# Altium schematic sheet M-LVDS PHY.SchDoc: Mordovia_MCH_CLK
size 420 x 297 mm; Date: 2021; DrawnBy: Filip Świtakowski; DocumentNumber: 3; Revision: 1.0; SheetNumber: 3; SheetTotal: 4; ModifiedBy: -; CheckedDate: -; Title2: M-LVDS PHY; DivGrp: WUT ISE; Designer: Filip Świtakowski
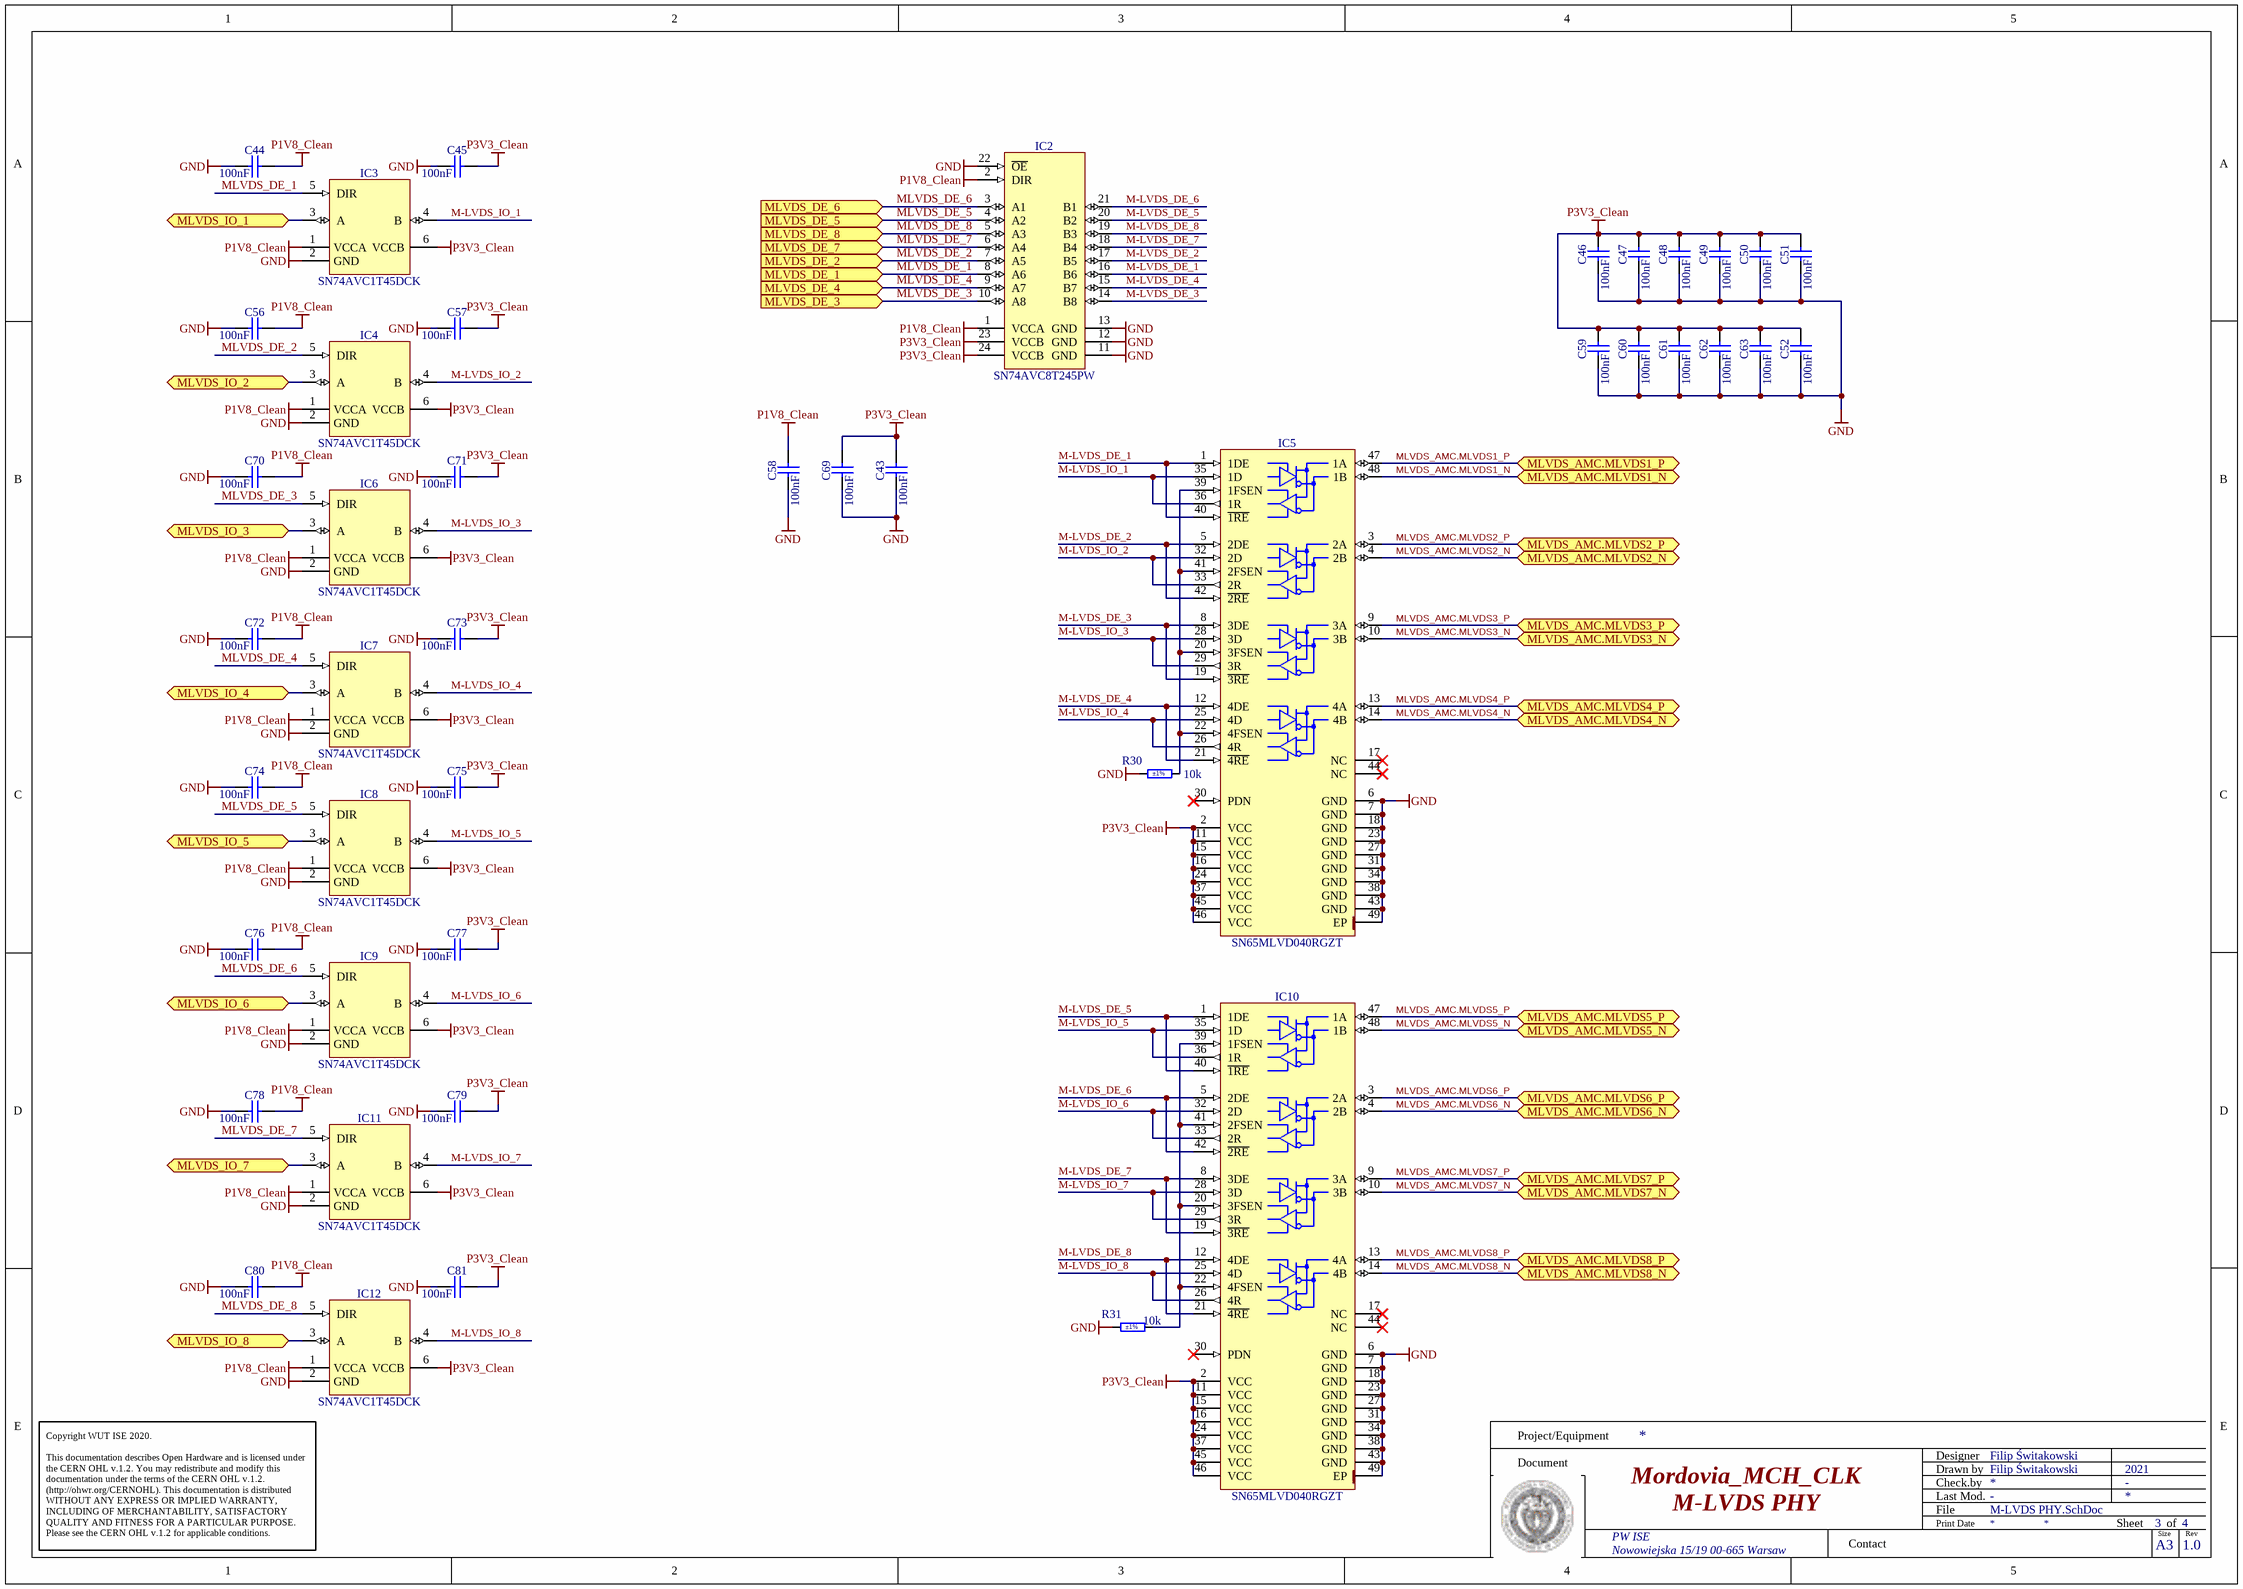
[diagram p0: M-LVDS PHY.SchDoc]

## Parts
C43  100nF  [CAPC1005X55N]
C44  100nF  [CAPC1005X55N]
C45  100nF  [CAPC1005X55N]
C46  100nF  [CAPC1005X55N]
C47  100nF  [CAPC1005X55N]
C48  100nF  [CAPC1005X55N]
C49  100nF  [CAPC1005X55N]
C50  100nF  [CAPC1005X55N]
C51  100nF  [CAPC1005X55N]
C52  100nF  [CAPC1005X55N]
C56  100nF  [CAPC1005X55N]
C57  100nF  [CAPC1005X55N]
C58  100nF  [CAPC1005X55N]
C59  100nF  [CAPC1005X55N]
C60  100nF  [CAPC1005X55N]
C61  100nF  [CAPC1005X55N]
C62  100nF  [CAPC1005X55N]
C63  100nF  [CAPC1005X55N]
C69  100nF  [CAPC1005X55N]
C70  100nF  [CAPC1005X55N]
C71  100nF  [CAPC1005X55N]
C72  100nF  [CAPC1005X55N]
C73  100nF  [CAPC1005X55N]
C74  100nF  [CAPC1005X55N]
C75  100nF  [CAPC1005X55N]
C76  100nF  [CAPC1005X55N]
C77  100nF  [CAPC1005X55N]
C78  100nF  [CAPC1005X55N]
C79  100nF  [CAPC1005X55N]
C80  100nF  [CAPC1005X55N]
C81  100nF  [CAPC1005X55N]
IC2  SN74AVC8T245PW  [SOP65P640X120-24N]
IC3  SN74AVC1T45DCK  [SOT65P210X110-6N]
IC4  SN74AVC1T45DCK  [SOT65P210X110-6N]
IC5  SN65MLVD040RGZT  [QFN50P700X700X100-49N-S420]
IC6  SN74AVC1T45DCK  [SOT65P210X110-6N]
IC7  SN74AVC1T45DCK  [SOT65P210X110-6N]
IC8  SN74AVC1T45DCK  [SOT65P210X110-6N]
IC9  SN74AVC1T45DCK  [SOT65P210X110-6N]
IC10  SN65MLVD040RGZT  [QFN50P700X700X100-49N-S420]
IC11  SN74AVC1T45DCK  [SOT65P210X110-6N]
IC12  SN74AVC1T45DCK  [SOT65P210X110-6N]
R30  10k  Tolerance: ±1%  [RESC1005X40N]
R31  10k  Tolerance: ±1%  [RESC1005X40N]

## Ports
MLVDS_AMC.MLVDS1_N (bidir), MLVDS_AMC.MLVDS1_P (bidir), MLVDS_AMC.MLVDS2_N (bidir), MLVDS_AMC.MLVDS2_P (bidir), MLVDS_AMC.MLVDS3_N (bidir), MLVDS_AMC.MLVDS3_P (bidir), MLVDS_AMC.MLVDS4_N (bidir), MLVDS_AMC.MLVDS4_P (bidir), MLVDS_AMC.MLVDS5_N (bidir), MLVDS_AMC.MLVDS5_P (bidir), MLVDS_AMC.MLVDS6_N (bidir), MLVDS_AMC.MLVDS6_P (bidir), MLVDS_AMC.MLVDS7_N (bidir), MLVDS_AMC.MLVDS7_P (bidir), MLVDS_AMC.MLVDS8_N (bidir), MLVDS_AMC.MLVDS8_P (bidir), MLVDS_DE_1 (in), MLVDS_DE_2 (in), MLVDS_DE_3 (in), MLVDS_DE_4 (in), MLVDS_DE_5 (in), MLVDS_DE_6 (in), MLVDS_DE_7 (in), MLVDS_DE_8 (in), MLVDS_IO_1 (bidir), MLVDS_IO_2 (bidir), MLVDS_IO_3 (bidir), MLVDS_IO_4 (bidir), MLVDS_IO_5 (bidir), MLVDS_IO_6 (bidir), MLVDS_IO_7 (bidir), MLVDS_IO_8 (bidir)

## Nets
GND: C43.1 C44.1 C45.1 C46.1 C47.1 C48.1 C49.1 C50.1 C51.1 C52.1 C56.1 C57.1 C58.1 C59.1 C60.1 C61.1 C62.1 C63.1 C69.1 C70.1 C71.1 C72.1 C73.1 C74.1 C75.1 C76.1 C77.1 C78.1 C79.1 C80.1 C81.1 IC2.11(GND) IC2.12(GND) IC2.13(GND) IC2.22(~{OE}) IC3.2(GND) IC4.2(GND) IC5.6(GND) IC5.7(GND) IC5.18(GND) IC5.23(GND) IC5.27(GND) IC5.31(GND) IC5.34(GND) IC5.38(GND) IC5.43(GND) IC5.49(EP) IC6.2(GND) IC7.2(GND) IC8.2(GND) IC9.2(GND) IC10.6(GND) IC10.7(GND) IC10.18(GND) IC10.23(GND) IC10.27(GND) IC10.31(GND) IC10.34(GND) IC10.38(GND) IC10.43(GND) IC10.49(EP) IC11.2(GND) IC12.2(GND) R30.1 R31.1
P1V8_Clean: C44.2 C56.2 C58.2 C70.2 C72.2 C74.2 C76.2 C78.2 C80.2 IC2.1(VCCA) IC2.2(DIR) IC3.1(VCCA) IC4.1(VCCA) IC6.1(VCCA) IC7.1(VCCA) IC8.1(VCCA) IC9.1(VCCA) IC11.1(VCCA) IC12.1(VCCA)
P3V3_Clean: C43.2 C45.2 C46.2 C47.2 C48.2 C49.2 C50.2 C51.2 C52.2 C57.2 C59.2 C60.2 C61.2 C62.2 C63.2 C69.2 C71.2 C73.2 C75.2 C77.2 C79.2 C81.2 IC2.23(VCCB) IC2.24(VCCB) IC3.6(VCCB) IC4.6(VCCB) IC5.2(VCC) IC5.11(VCC) IC5.15(VCC) IC5.16(VCC) IC5.24(VCC) IC5.37(VCC) IC5.45(VCC) IC5.46(VCC) IC6.6(VCCB) IC7.6(VCCB) IC8.6(VCCB) IC9.6(VCCB) IC10.2(VCC) IC10.11(VCC) IC10.15(VCC) IC10.16(VCC) IC10.24(VCC) IC10.37(VCC) IC10.45(VCC) IC10.46(VCC) IC11.6(VCCB) IC12.6(VCCB)
M-LVDS_DE_1: IC2.16(B6) IC5.1(1DE) IC5.40(~{1RE})
M-LVDS_DE_2: IC2.17(B5) IC5.5(2DE) IC5.42(~{2RE})
M-LVDS_DE_3: IC2.14(B8) IC5.8(3DE) IC5.19(~{3RE})
M-LVDS_DE_4: IC2.15(B7) IC5.12(4DE) IC5.21(~{4RE})
M-LVDS_DE_5: IC2.20(B2) IC10.1(1DE) IC10.40(~{1RE})
M-LVDS_DE_6: IC2.21(B1) IC10.5(2DE) IC10.42(~{2RE})
M-LVDS_DE_7: IC2.18(B4) IC10.8(3DE) IC10.19(~{3RE})
M-LVDS_DE_8: IC2.19(B3) IC10.12(4DE) IC10.21(~{4RE})
M-LVDS_IO_1: IC3.4(B) IC5.35(1D) IC5.36(1R)
M-LVDS_IO_2: IC4.4(B) IC5.32(2D) IC5.33(2R)
M-LVDS_IO_3: IC5.28(3D) IC5.29(3R) IC6.4(B)
M-LVDS_IO_4: IC5.25(4D) IC5.26(4R) IC7.4(B)
M-LVDS_IO_5: IC8.4(B) IC10.35(1D) IC10.36(1R)
M-LVDS_IO_6: IC9.4(B) IC10.32(2D) IC10.33(2R)
M-LVDS_IO_7: IC10.28(3D) IC10.29(3R) IC11.4(B)
M-LVDS_IO_8: IC10.25(4D) IC10.26(4R) IC12.4(B)
MLVDS_AMC.MLVDS1_N: IC5.48(1B) ; port MLVDS_AMC.MLVDS1_N
MLVDS_AMC.MLVDS1_P: IC5.47(1A) ; port MLVDS_AMC.MLVDS1_P
MLVDS_AMC.MLVDS2_N: IC5.4(2B) ; port MLVDS_AMC.MLVDS2_N
MLVDS_AMC.MLVDS2_P: IC5.3(2A) ; port MLVDS_AMC.MLVDS2_P
MLVDS_AMC.MLVDS3_N: IC5.10(3B) ; port MLVDS_AMC.MLVDS3_N
MLVDS_AMC.MLVDS3_P: IC5.9(3A) ; port MLVDS_AMC.MLVDS3_P
MLVDS_AMC.MLVDS4_N: IC5.14(4B) ; port MLVDS_AMC.MLVDS4_N
MLVDS_AMC.MLVDS4_P: IC5.13(4A) ; port MLVDS_AMC.MLVDS4_P
MLVDS_AMC.MLVDS5_N: IC10.48(1B) ; port MLVDS_AMC.MLVDS5_N
MLVDS_AMC.MLVDS5_P: IC10.47(1A) ; port MLVDS_AMC.MLVDS5_P
MLVDS_AMC.MLVDS6_N: IC10.4(2B) ; port MLVDS_AMC.MLVDS6_N
MLVDS_AMC.MLVDS6_P: IC10.3(2A) ; port MLVDS_AMC.MLVDS6_P
MLVDS_AMC.MLVDS7_N: IC10.10(3B) ; port MLVDS_AMC.MLVDS7_N
MLVDS_AMC.MLVDS7_P: IC10.9(3A) ; port MLVDS_AMC.MLVDS7_P
MLVDS_AMC.MLVDS8_N: IC10.14(4B) ; port MLVDS_AMC.MLVDS8_N
MLVDS_AMC.MLVDS8_P: IC10.13(4A) ; port MLVDS_AMC.MLVDS8_P
MLVDS_DE_1: IC2.8(A6) IC3.5(DIR) ; port MLVDS_DE_1
MLVDS_DE_2: IC2.7(A5) IC4.5(DIR) ; port MLVDS_DE_2
MLVDS_DE_3: IC2.10(A8) IC6.5(DIR) ; port MLVDS_DE_3
MLVDS_DE_4: IC2.9(A7) IC7.5(DIR) ; port MLVDS_DE_4
MLVDS_DE_5: IC2.4(A2) IC8.5(DIR) ; port MLVDS_DE_5
MLVDS_DE_6: IC2.3(A1) IC9.5(DIR) ; port MLVDS_DE_6
MLVDS_DE_7: IC2.6(A4) IC11.5(DIR) ; port MLVDS_DE_7
MLVDS_DE_8: IC2.5(A3) IC12.5(DIR) ; port MLVDS_DE_8
MLVDS_IO_1: IC3.3(A) ; port MLVDS_IO_1
MLVDS_IO_2: IC4.3(A) ; port MLVDS_IO_2
MLVDS_IO_3: IC6.3(A) ; port MLVDS_IO_3
MLVDS_IO_4: IC7.3(A) ; port MLVDS_IO_4
MLVDS_IO_5: IC8.3(A) ; port MLVDS_IO_5
MLVDS_IO_6: IC9.3(A) ; port MLVDS_IO_6
MLVDS_IO_7: IC11.3(A) ; port MLVDS_IO_7
MLVDS_IO_8: IC12.3(A) ; port MLVDS_IO_8
NetIC5_20: IC5.20(3FSEN) IC5.22(4FSEN) IC5.39(1FSEN) IC5.41(2FSEN) R30.2
NetIC10_20: IC10.20(3FSEN) IC10.22(4FSEN) IC10.39(1FSEN) IC10.41(2FSEN) R31.2

Not connected (* = marked no-connect by the designer): IC5 17(NC)* 30(PDN)* 44(NC)*; IC10 17(NC)* 30(PDN)* 44(NC)*

## Notes on the sheet
- Project/Equipment
- Document
- Designer
- Drawn by
- Check.by
- Copyright WUT ISE 2020.
  This documentation describes Open Hardware and is licensed under the CERN OHL v.1.2. You may redistribute and modify this documentation under the terms of the CERN OHL v.1.2. (http://ohwr.org/CERNOHL). This documentation is distributed WITHOUT ANY EXPRESS OR IMPLIED WARRANTY, INCLUDING OF MERCHANTABILITY, SATISFACTORY QUALITY AND FITNESS FOR A PARTICULAR PURPOSE. Please see the CERN OHL v.1.2 for applicable conditions.
- PW ISE
- Contact
- File
- Last Mod.
- Print Date
- Sheet
- Size
- A3
- of
- Rev
- Nowowiejska 15/19 00-665 Warsaw

## Library data of the parts
C43-C52 C56-C63 C69-C81 = CC0402_100NF_50V_10%_X7R: Non-polarised capacitor; Part Description: SMD Multilayer Chip Ceramic Capacitor; Manufacturer: GENERIC; Manufacturer1 Part Number: GRM155R71H104KE14D; Voltage: 50V; TC: X7R; Tolerance: ±10%; Part Number: CC0402_100NF_50V_10%_X7R; Component Kind: Standard; Component Type: Standard; Pin Count: 2; Value: 100nF; Status: None; Manufacturer Part Number: CC0402_100NF_50V_10%_X7R; Case: 0402; Mounted: Yes; Socket: No; SMD: Yes; Sense: No; Manufacturer1 Example: MURATA; Manufacturer1 ComponentHeight: 0.55mm; HelpURL: \\cern.ch\dfs\Applications\Altium\Datasheets\CC0402_MURATA_GRM155R71H104KE14D.pdf; Author: CERN DEM MR; CreateDate: 30.06.2017; LatestRevisionDate: 30.06.2017
IC2 = SN74AVC8T245PW: 8-Bit Dual-Supply Bus Transceiver With Configurable Voltage Translation and 3-State Outputs; Manufacturer: TEXAS INSTRUMENTS; PressFit: No; Bonding: No; Part Number: SN74AVC8T245PW; Component Kind: Standard; Component Type: Standard; Device: SN74AVC8T245PW; PackageDescription: SOP, 0.65mm Pitch; 24 Pin, 4.40mm W X 7.80mm L X 1.20mm H Body, IPC Medium Density; Part Description: 8-Bit Dual-Supply Bus Transceiver With Configurable Voltage Translation and 3-State Outputs; Manufacturer Part Number: SN74AVC8T245PW; Pin Count: 24; Case: TSSOP24; Mounted: Yes; Socket: No; SMD: Yes; Sense: No; ComponentHeight: 1.2mm; Author: CERN DEM JLC; HelpURL: \\cern.ch\dfs\Applications\Altium\Datasheets\SN74AVC8T245PW.pdf; CreateDate: 07.03.2012; LatestRevisionDate: 07.03.2012
IC3 IC4 IC6-IC9 IC11 IC12 = SN74AVC1T45DCKR: Single-Bit Dual-Supply Bus Transceiver; Part Description: Single-Bit Dual-Supply Bus Transceiver with Configurable Voltage Translation and 3-State Outputs; Manufacturer: TEXAS INSTRUMENTS; PressFit: No; Bonding: No; Part Number: SN74AVC1T45DCKR; Component Kind: Standard; Component Type: Standard; Device: SN74AVC1T45DCK; PackageDescription: SOT363, SC70-6, 0.65mm Pitch; 6 pin, 1.25mm W X 2.00mm L X 1.10mm H body, IPC Medium Density; Manufacturer Part Number: SN74AVC1T45DCK; Pin Count: 6; Case: SOT363; Mounted: Yes; Socket: No; SMD: Yes; Sense: No; ComponentHeight: 1.1mm; Author: CERN DEM JLC; HelpURL: \\cern.ch\dfs\Applications\Altium\Datasheets\SN74AVC1T45DCKR.pdf; CreateDate: 07.07.2014; LatestRevisionDate: 07.07.2014
IC5 IC10 = SN65MLVD040RGZT: 4-Channel Half-Duplex M-LVDS Line Transceiver; Manufacturer: TEXAS INSTRUMENTS; PressFit: No; Bonding: No; Part Number: SN65MLVD040RGZT; Component Kind: Standard; Component Type: Standard; Device: SN65MLVD040RGZT; PackageDescription: QFN, 0.50mm Pitch, Square; 48 Pin, 7.00mm L X 7.00mm W X 1.00mm H body (w/Thermal Tab 4.20 X 4.20mm), IPC Medium Density; Part Description: 4-Channel Half-Duplex M-LVDS Line Transceiver; Manufacturer Part Number: SN65MLVD040RGZT; Pin Count: 49; Case: QFN48; Mounted: Yes; Socket: No; SMD: Yes; Sense: No; ComponentHeight: 1mm; Author: CERN DEM JLC; HelpURL: \\cern.ch\dfs\Applications\Altium\Datasheets\SN65MLVD040RGZT.pdf; CreateDate: 17.03.2011; LatestRevisionDate: 17.03.2011
R30 R31 = R0402_10K_1%_0.0625W_100PPM: Resistor - 1%; Part Description: General Purpose Thick Film Chip Resistor; Manufacturer: GENERIC; Manufacturer1 Part Number: 232270671003L; TC: ±100ppm/°C; PressFit: No; Part Number: R0402_10K_1%_0.0625W_100PPM; Component Kind: Standard; Component Type: Standard; Pin Count: 2; Value: 10k; Status: Not Recommended; Power: 0.0625W; Manufacturer Part Number: R0402_10K_1%_0.0625W_100PPM; Case: 0402; Mounted: Yes; Sense: No; Socket: No; SMD: Yes; Manufacturer1 Example: YAGEO PHYCOMP; Manufacturer1 ComponentHeight: 0.4mm; HelpURL: \\cern.ch\dfs\Applications\Altium\Datasheets\R0402_Phycomp_RC0402.pdf; Author: CERN DEM JLC; CreateDate: 03.12.2007; LatestRevisionDate: 17.10.2012